# EAGLE design rc-light-controller (EAGLE 5.12)
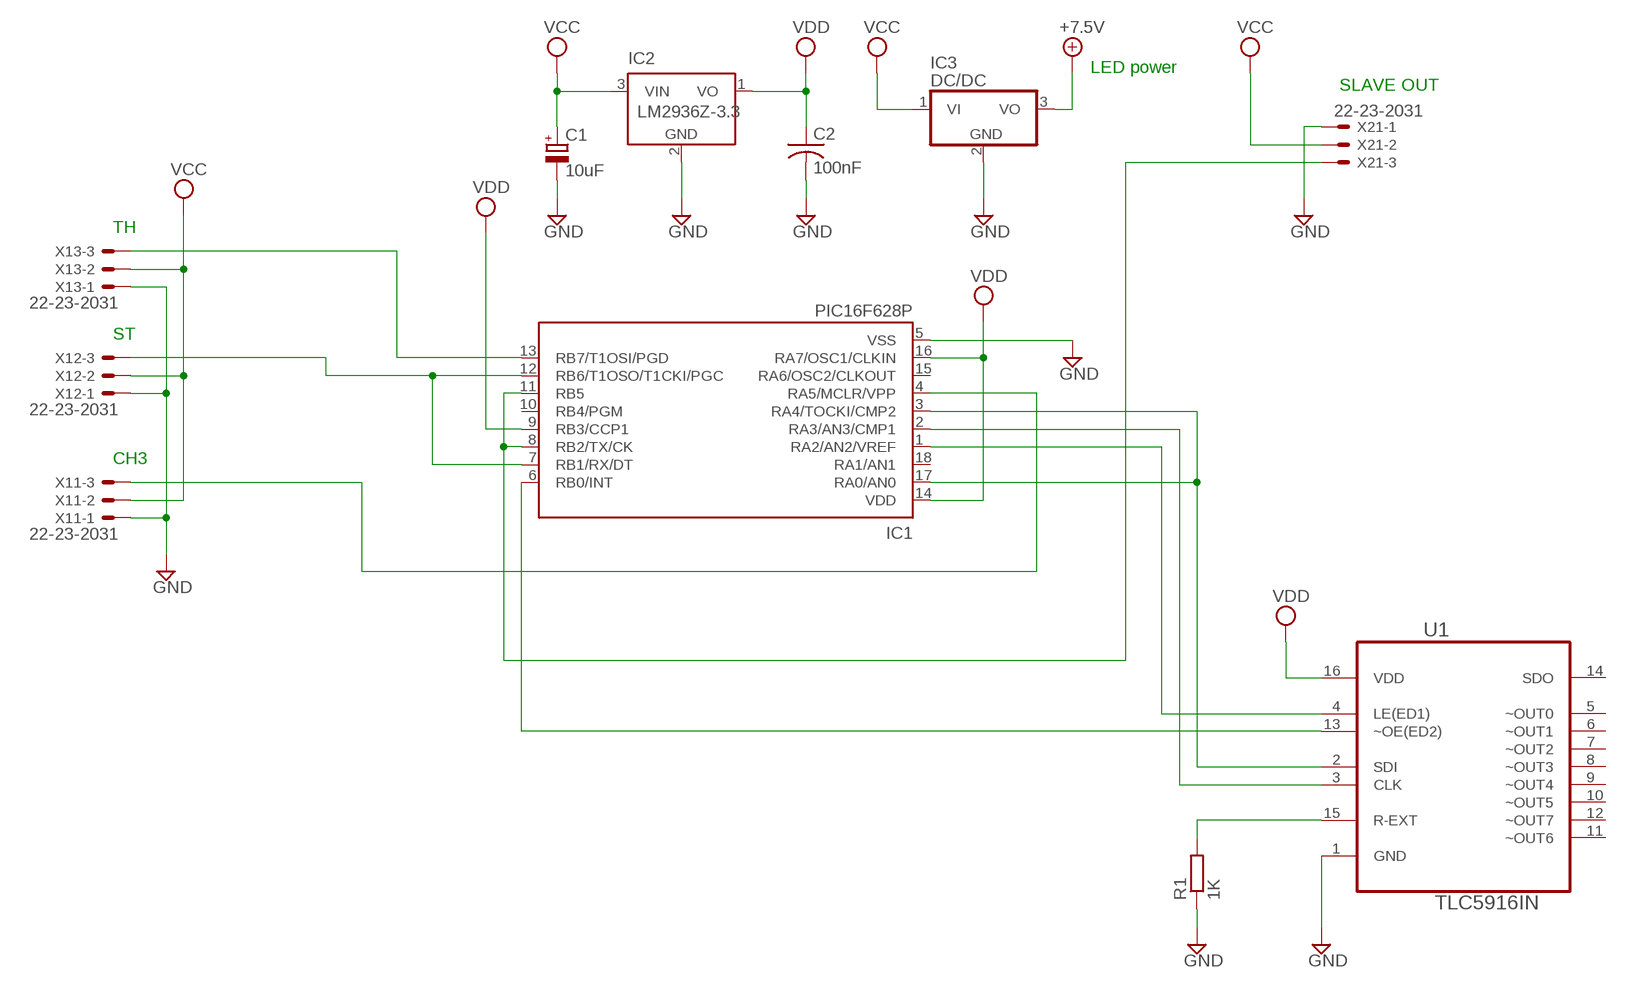
[diagram p0: schematic, sheet 1]

## Parts
C1  10uF  CPOL-EUE5-5  [E5-5]
C2  100nF  C-US025-025X050  [C025-025X050]
IC1  PIC16F628P  [DIL18]
IC2  LM2936Z-3.3  [TO92]
IC3  DC/DC  7805T  [TO220H]
R1  1K  R-EU_0204/7  [0204/7]
U1  TLC5916IN  [DIP254P762X508-16]
X11  22-23-2031  [22-23-2031]
X12  22-23-2031  [22-23-2031]
X13  22-23-2031  [22-23-2031]
X21  22-23-2031  [22-23-2031]

## Nets
+9V: IC3.3(VO) ; supply symbol labelled +7.5V
GND: C1.- C2.2 IC1.5(VSS) IC2.2(GND) IC3.2(GND) R1.1 U1.1(GND) X11.1 X12.1 X13.1 X21.1
N$1: R1.2 U1.15(R-EXT)
N$2: IC1.2(RA3/AN3/CMP1) U1.3(CLK)
N$3: IC1.3(RA4/TOCKI/CMP2) IC1.17(RA0/AN0) U1.2(SDI)
N$4: IC1.4(RA5/MCLR/VPP) X11.3
N$5: IC1.7(RB1/RX/DT) IC1.12(RB6/T1OSO/T1CKI/PGC) X12.3
N$6: IC1.13(RB7/T1OSI/PGD) X13.3
N$7: IC1.1(RA2/AN2/VREF) U1.4(LE(ED1))
N$8: IC1.6(RB0/INT) U1.13(~OE(ED2))
N$23: IC1.8(RB2/TX/CK) IC1.11(RB5) X21.3
VCC: C1.+ IC2.3(VIN) IC3.1(VI) X11.2 X12.2 X13.2 X21.2
VDD: C2.1 IC1.9(RB3/CCP1) IC1.14(VDD) IC1.16(RA7/OSC1/CLKIN) IC2.1(VO) U1.16(VDD)
Unconnected: IC1.10(RB4/PGM) IC1.15(RA6/OSC2/CLKOUT) IC1.18(RA1/AN1) U1.5(~OUT0) U1.6(~OUT1) U1.7(~OUT2) U1.8(~OUT3) U1.9(~OUT4) U1.10(~OUT5) U1.11(~OUT6) U1.12(~OUT7) U1.14(SDO)

## Notes on the sheet
- LED power
- SLAVE OUT
- TH
- ST
- CH3

## Library data of the parts
C1 = resistor:CPOL-EU: POLARIZED CAPACITOR, European symbol
C2 = rcl:C-US: CAPACITOR, American symbol
IC1 = microchip:PIC16F62*: FLASH-Based 8-Bit CMOS Microcontroller Source: http://ww1.microchip.com/downloads/en/DeviceDoc/40300C.pdf
IC2 = national-semiconductor:LM2936?*: Ultra-Low Quiescent Current LDO Voltage Regulator Source: Data sheet <http://www.national.com/ds/LM/LM2936.pdf>; MF: NATIONAL SEMICONDUCTOR; MPN: LM2936Z-3.3/NOPB; OC_FARNELL: 1564641; OC_NEWARK: 41K4532
IC3 = linear:78*: Positive VOLTAGE REGULATOR Source: http://cache.national.com/ds/LM/LM78L05.pdf http://www.fairchildsemi.com/ds/LM/LM7805.pdf
R1 = resistor:R-EU_: RESISTOR, European symbol
U1 = TI-TLC5916IN:TLC5916IN: 8-CHANNEL CONSTANT-CURRENT LED SINK DRIVERS; MPN: TLC5916IN; OC_FARNELL: 1647814; OC_NEWARK: 60M1749; PACKAGE: PDIP-16; SUPPLIER: Texas Instruments
X11-X13 X21 = con-molex:22-23-2031: .100" (2.54mm) Center Header - 3 Pin

## Board
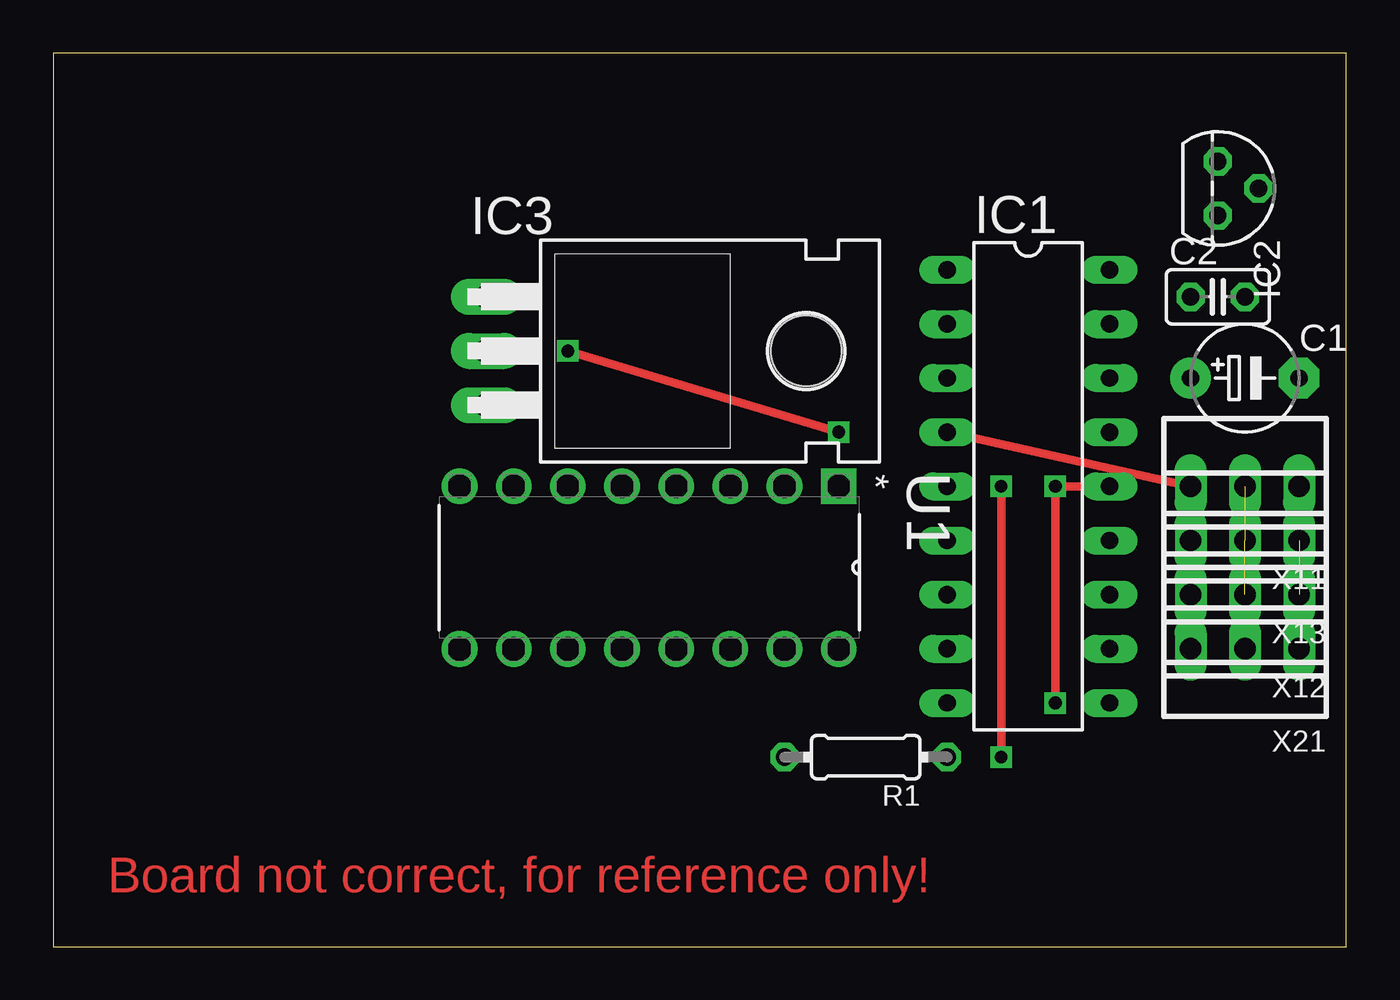
[diagram p1: board, top side]
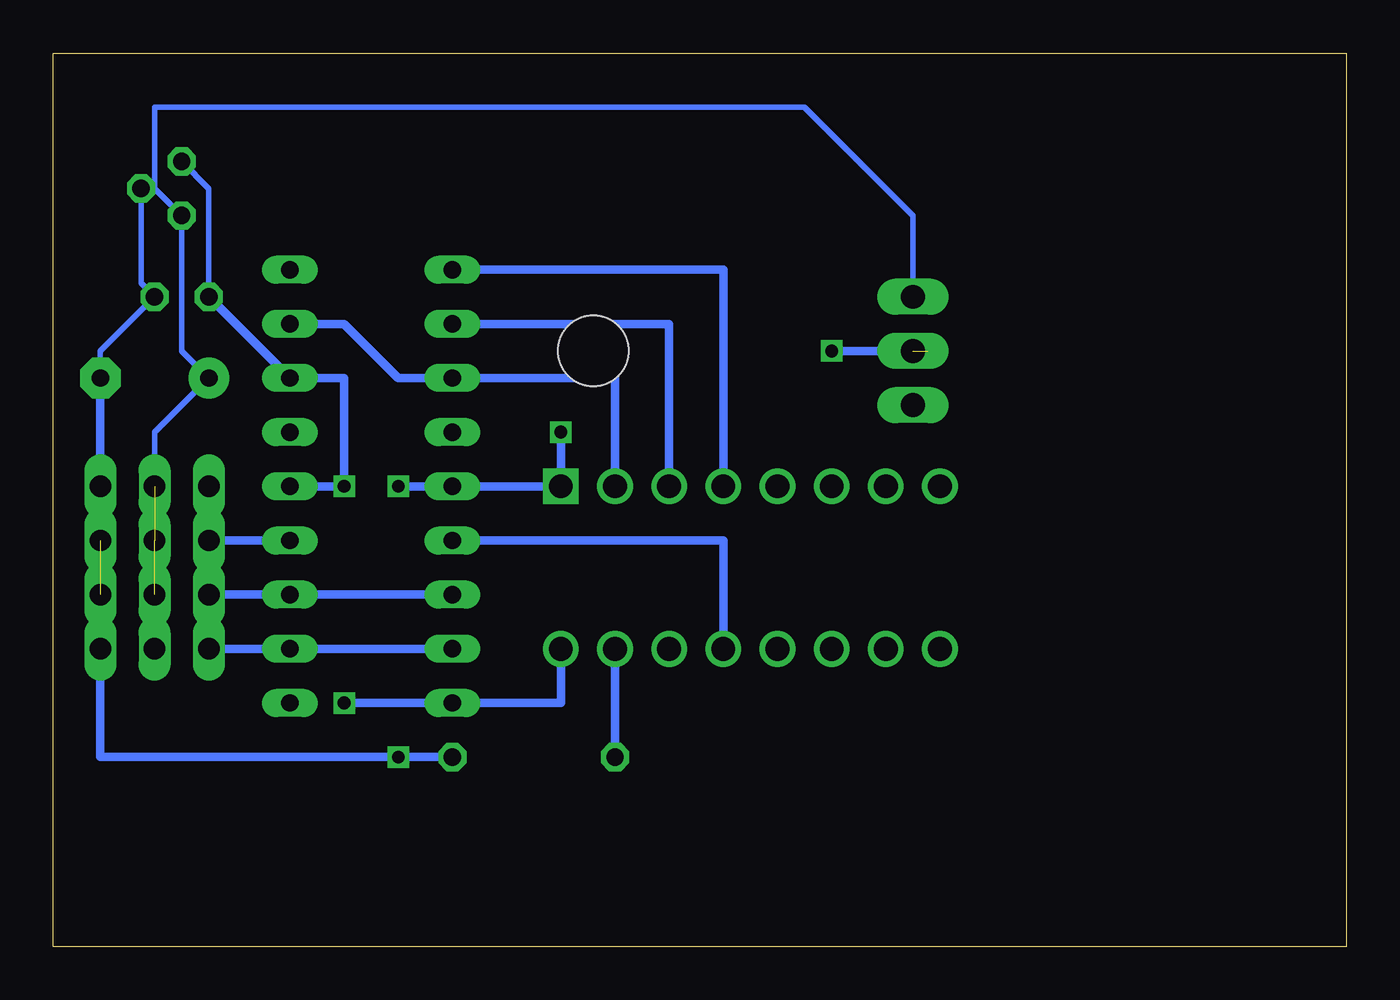
[diagram p2: board, bottom side, seen from below]

Size 60.63 x 41.9 mm. Coordinates in mm from the lower left corner, seen from the top.
Outline: 0,0 60.63,0 60.63,41.9 0,41.9 0,0
Copper layers (1*16): Top 0.035mm / dielectric 1.5mm / Bottom 0.035mm
Design rules "default": minimum track width 10mil, minimum drill 24mil, track to track 8mil, track to pad 8mil, pad to pad 8mil, via to via 8mil, smd to smd 8mil, copper to edge 40mil, drill to drill 8mil, minimum pad ring 10mil, minimum via ring 8mil, stop-mask expansion 4mil, vias tented up to drill 0mil, thermal gap 10mil

### Footprints (pad centres in the part's own frame; a part is rotated, then mirrored left to right if it is on the bottom)
E5-5 = drill 0.813 pad 1.905 round: + -2.54,0 | drill 0.813 pad 1.905 octagon: - 2.54,0
C025-025X050 = drill 0.813 octagon: 1 -1.27,0; 2 1.27,0
DIL18 = drill 0.813 long: 1 -10.16,-3.81; 2 -7.62,-3.81; 3 -5.08,-3.81; 4 -2.54,-3.81; 5 0,-3.81; 6 2.54,-3.81; 7 5.08,-3.81; 8 7.62,-3.81; 9 10.16,-3.81; 10 10.16,3.81; 11 7.62,3.81; 12 5.08,3.81; 13 2.54,3.81; 14 0,3.81; 15 -2.54,3.81; 16 -5.08,3.81; 17 -7.62,3.81; 18 -10.16,3.81
TO92 = drill 0.813 pad 1.27 octagon: 1 -1.27,0; 2 0,1.905; 3 1.27,0
TO220H = drill 1.118 long: 1 -2.54,-10.16; 2 0,-10.16; 3 2.54,-10.16 | hole 3.302: 0,4.826
0204/7 = drill 0.813 octagon: 1 -3.81,0; 2 3.81,0
DIP254P762X508-16 = drill 1.118 square: 1 -7.62,17.78 | drill 1.118 round: 2 -7.62,15.24; 3 -7.62,12.7; 4 -7.62,10.16; 5 -7.62,7.62; 6 -7.62,5.08; 7 -7.62,2.54; 8 -7.62,0; 9 0,0; 10 0,2.54; 11 0,5.08; 12 0,7.62; 13 0,10.16; 14 0,12.7; 15 0,15.24; 16 0,17.78
22-23-2031 = drill 1 long: 1 -2.54,0; 2 0,0; 3 2.54,0

### Placement (x,y rotation side)
C1  55.88,26.67 0 top
C2  54.61,30.48 0 top
IC1  45.72,21.59 270 top
IC2  54.61,35.56 270 top
IC3  30.48,27.94 270 top
R1  38.1,8.89 180 top
U1  19.05,13.97 270 top
X11  55.88,21.59 180 top
X12  55.88,16.51 180 top
X13  55.88,19.05 180 top
X21  55.88,13.97 180 top

### Tracks (layer width: path | path; a pad name or v marks a point on that pad's centre or on a via)
GND  (via drill 0.6)  (2 unrouted)
  Top 0.406: v44.45,21.59 v44.45,8.89 | v24.13,27.94 v36.83,24.13
  Bottom 0.254: C1.- 58.42,27.94 C2.2 56.52,31.12 IC2.2
  Bottom 0.406: C1.- X11.1 X13.1 X21.1 58.42,8.89 v44.45,8.89 R1.1 | v44.45,21.59 IC1.5 U1.1 v36.83,24.13 | 19.61,27.94 v24.13,27.94
N$1
  Bottom 0.406: R1.2 U1.15
N$2
  Bottom 0.406: IC1.2 31.75,29.21 U1.3
N$3
  Bottom 0.406: U1.2 34.29,26.67 IC1.3 44.45,26.67 46.99,29.21 IC1.17
N$4
  Top 0.406: IC1.4 X11.3
N$5
  Bottom 0.406: X12.3 IC1.12 IC1.7
N$6
  Bottom 0.406: IC1.13 X13.3
N$7
  Bottom 0.406: U1.4 29.21,31.75 IC1.1
N$8
  Bottom 0.406: U1.13 29.21,19.05 IC1.6
N$9  (via drill 0.6)
  other vias: 46.99,11.43
N$10  (via drill 0.6)
  other vias: 46.99,21.59
N$11  (via drill 0.6)
  other vias: 44.45,21.59
N$12  (via drill 0.6)
  other vias: 24.13,27.94
N$13  (via drill 0.6)
  other vias: 36.83,24.13
N$23
  Bottom 0.406: X21.3 IC1.11 IC1.8
VCC  (2 unrouted)
  Bottom 0.254: X11.2 55.88,24.13 C1.+ 54.61,27.94 IC2.3 55.88,35.56 55.88,39.37 25.4,39.37 20.32,34.29 IC3.1
  Bottom 0.406: X11.2 X21.2
VDD  (via drill 0.6)
  Top 0.406: v46.99,11.43 46.99,21.59 IC1.14
  Bottom 0.254: C2.1 53.34,35.56 IC2.1
  Bottom 0.406: U1.16 36.83,11.43 IC1.9 v46.99,11.43 | IC1.14 46.99,21.59 46.99,26.67 IC1.16 C2.1

### Text on the board
Top: Board not correct, for reference only!